# Altium schematic sheet [02] MainBoard.SchDoc
size A4
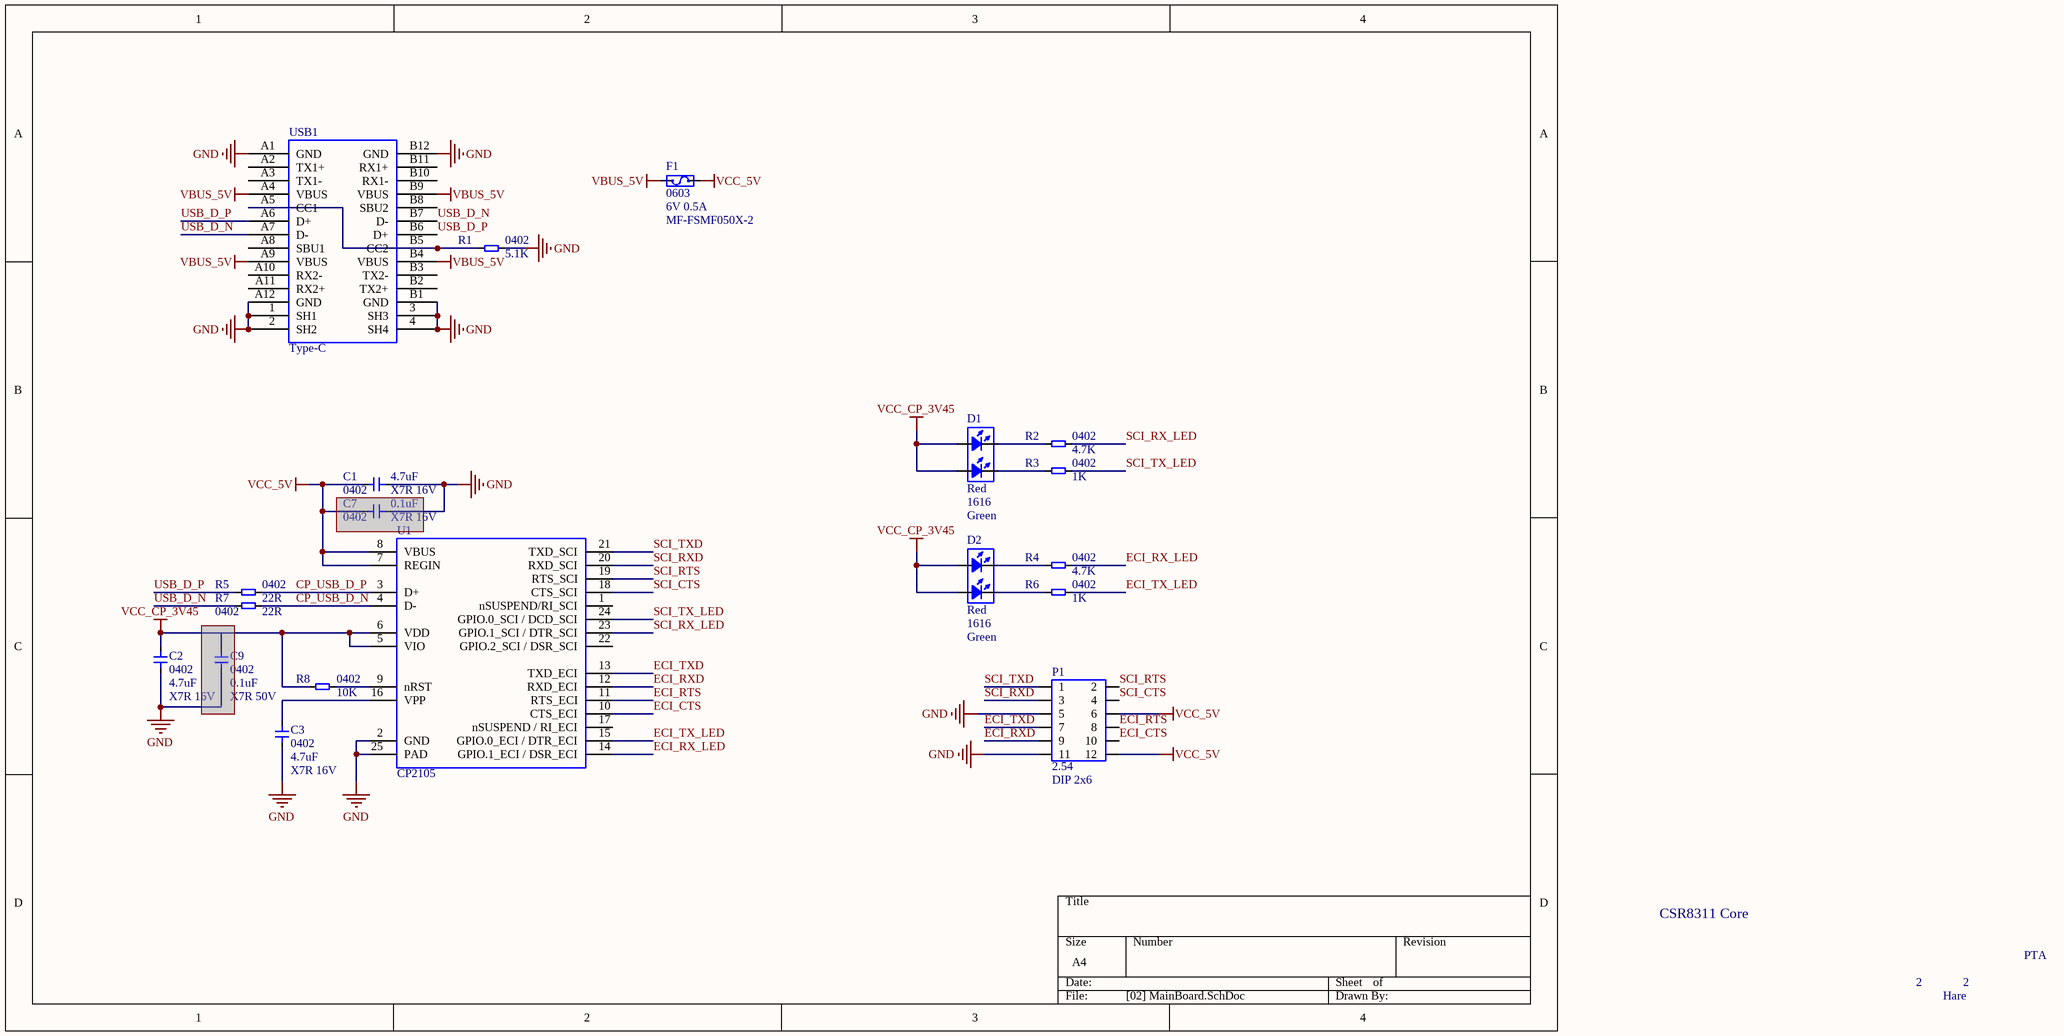
[diagram p0: [02] MainBoard.SchDoc]

## Parts
C1  Footprint: 0402  Specification: X7R 16V  [CAP_0402]  (hidden comment: 4.7uF)
C2  Footprint: 0402  Specification: X7R 16V  [CAP_0402]  (hidden comment: 4.7uF)
C3  Footprint: 0402  Specification: X7R 16V  [CAP_0402]  (hidden comment: 4.7uF)
C7  Footprint: 0402  Specification: X7R 16V  [CAP_0402]  (hidden comment: 0.1uF)  (masked out: inside a compile mask, not in the netlist)
C9  Footprint: 0402  Specification: X7R 50V  [CAP_0402]  (hidden comment: 0.1uF)  (masked out: inside a compile mask, not in the netlist)
D1  Value2: Red  Footprint: 1616  Value1: Green  [LED_1616]
D2  Value2: Red  Footprint: 1616  Value1: Green  [LED_1616]
F1  Footprint: 0603  Specification: 6V 0.5A  [FUSE_0603]  (hidden comment: MF-FSMF050X-2)
P1  Type: 2.54  [HDR2X6_2.54_180H]  (hidden comment: DIP 2x6)
R1  Footprint: 0402  [RES_0402]  (hidden comment: 5.1K)
R2  Footprint: 0402  [RES_0402]  (hidden comment: 4.7K)
R3  Footprint: 0402  [RES_0402]  (hidden comment: 1K)
R4  Footprint: 0402  [RES_0402]  (hidden comment: 4.7K)
R5  Footprint: 0402  [RES_0402]  (hidden comment: 22R)
R6  Footprint: 0402  [RES_0402]  (hidden comment: 1K)
R7  Footprint: 0402  [RES_0402]  (hidden comment: 22R)
R8  Footprint: 0402  [RES_0402]  (hidden comment: 10K)
U1  CP2105  [QFN-24-4.0X4.0-P0.5]
USB1  Type-C  [USB-Type-C]

## Nets
GND: C1.2 C2.2 C3.2 P1.5 P1.11 R1.1 U1.2(GND) U1.25(PAD) USB1.1(SH1) USB1.2(SH2) USB1.3(SH3) USB1.4(SH4) USB1.A1(GND) USB1.A12(GND) USB1.B1(GND) USB1.B12(GND)
VBUS_5V: F1.1 USB1.A4(VBUS) USB1.A9(VBUS) USB1.B4(VBUS) USB1.B9(VBUS)
VCC_5V: C1.1 F1.2 P1.6 P1.12 U1.7(REGIN) U1.8(VBUS)
VCC_CP_3V45: C2.1 D1.3 D1.4 D2.3 D2.4 R8.1 U1.5(VIO) U1.6(VDD)
CP_USB_D_N: R7.1 U1.4(D-)
CP_USB_D_P: R5.1 U1.3(D+)
ECI_CTS: P1.10 U1.10(CTS_ECI)
ECI_RTS: P1.8 U1.11(RTS_ECI)
ECI_RX_LED: R4.1 U1.14(GPIO.1_ECI_/_DSR_ECI)
ECI_RXD: P1.9 U1.12(RXD_ECI)
ECI_TX_LED: R6.1 U1.15(GPIO.0_ECI_/_DTR_ECI)
ECI_TXD: P1.7 U1.13(TXD_ECI)
SCI_CTS: P1.4 U1.18(CTS_SCI)
SCI_RTS: P1.2 U1.19(RTS_SCI)
SCI_RX_LED: R2.1 U1.23(GPIO.1_SCI_/_DTR_SCI)
SCI_RXD: P1.3 U1.20(RXD_SCI)
SCI_TX_LED: R3.1 U1.24(GPIO.0_SCI_/_DCD_SCI)
SCI_TXD: P1.1 U1.21(TXD_SCI)
USB_D_N: R7.2 USB1.A7(D-) USB1.B7(D-)
USB_D_P: R5.2 USB1.A6(D+) USB1.B6(D+)
NetC3_1: C3.1 U1.16(VPP)
NetD1_1: D1.1 R2.2
NetD1_2: D1.2 R3.2
NetD2_1: D2.1 R4.2
NetD2_2: D2.2 R6.2
NetR1_2: R1.2 USB1.A5(CC1) USB1.B5(CC2)
NetR8_2: R8.2 U1.9(nRST)

Not connected (* = marked no-connect by the designer): U1 1(nSUSPEND/RI_SCI) 17(nSUSPEND_/_RI_ECI) 22(GPIO.2_SCI_/_DSR_SCI); USB1 A2(TX1+) A3(TX1-) A8(SBU1) A10(RX2-) A11(RX2+) B2(TX2+) B3(TX2-) B8(SBU2) B10(RX1-) B11(RX1+)

## Notes on the sheet
- CSR8311 Core
- 2
- PTA
- Hare
- Title
- Size:
- Date:
- A4
- Number:
- Time:
- Revision:
- Sheet
- of
- File:

## Library data of the parts
C1-C3 C7 C9 = CAP: Capacitor; Manufacturer: *
  C1-C3: Value: 4.7uF
  C7 C9: Value: 0.1uF
D1 D2 = LEDx2: LED双色
F1 = Fuse: Manufacturer: *; Value: MF-FSMF050X-2
P1 = HDR2x6: Header; Value: DIP 2x6
R1-R8 = RES: Resistor; Specification: ±1%; Manufacturer: *
  R1: Value: 5.1K
  R2 R4: Value: 4.7K
  R3 R6: Value: 1K
  R5 R7: Value: 22R
  R8: Value: 10K
U1 = CP2105: Single-Chip USB to Dual UART Data Transfer
USB1 = USB-Type-C